# Altium project 4ADI_2DO.PrjPCB (part 5 of 6)

## Sheet AnalogOutputs.SchDoc
size A3
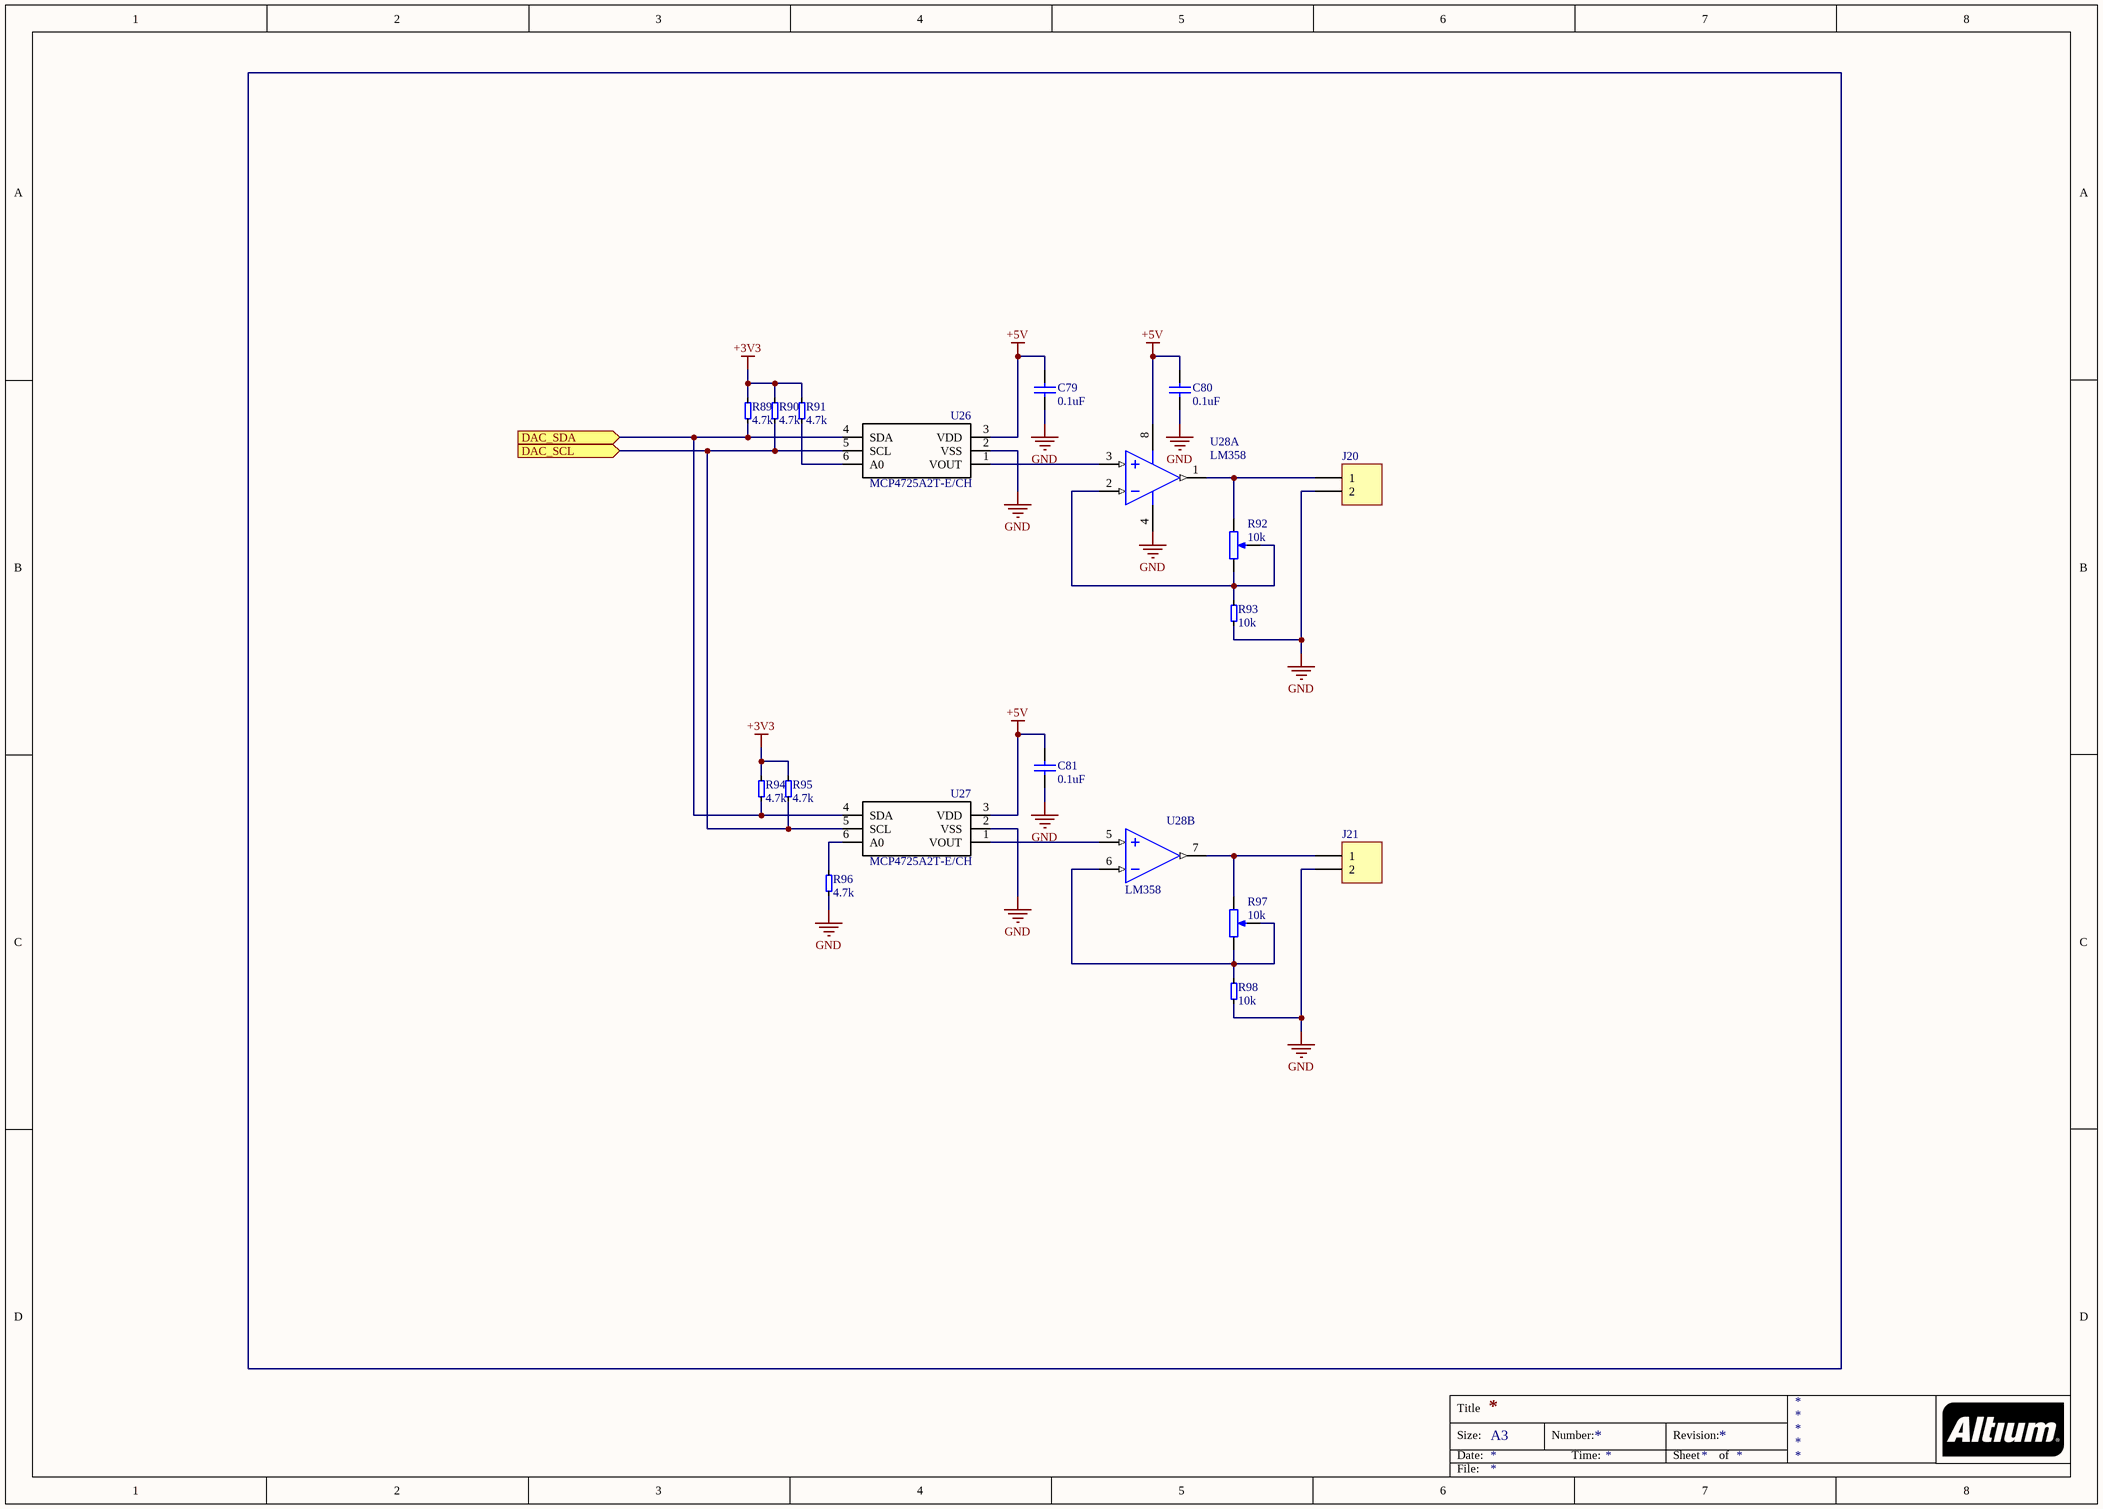
[diagram p5: AnalogOutputs.SchDoc]

### Parts
C79  0.1uF  [C_ceramic_0603]
C80  0.1uF  [C_ceramic_0603]
C81  0.1uF  [C_ceramic_0603]
J20  CIM025P5  [HDR1X2]  (value not drawn)
J21  CIM025P5  [HDR1X2]  (value not drawn)
R89  4.7k  [R_0603]
R90  4.7k  [R_0603]
R91  4.7k  [R_0603]
R92  10k  [ST4EA_Trimmer]
R93  10k  [R_0603]
R94  4.7k  [R_0603]
R95  4.7k  [R_0603]
R96  4.7k  [R_0603]
R97  10k  [ST4EA_Trimmer]
R98  10k  [R_0603]
U26  MCP4725A2T-E/CH  [SOT-23-6_MC]
U27  MCP4725A2T-E/CH  [SOT-23-6_MC]
U28  LM358  [SOIC-8 - 3.9mm Body]  (parts A,B of 2)

### Ports
DAC_SCL (in), DAC_SDA (in)

### Nets
+3V3: R89.1 R90.1 R91.1 R94.1 R95.1
+5v: C79.2 C80.2 C81.2 U26.3(VDD) U27.3(VDD) U28.8(V+)
GND: C79.1 C80.1 C81.1 J20.2 J21.2 R93.2 R96.2 R98.2 U26.2(VSS) U27.2(VSS) U28.4(GND)
NetJ20_1: J20.1 R92.1(TOP) U28.1(OUT_A)
NetJ21_1: J21.1 R97.1(TOP) U28.7(OUT_B)
NetR89_2: R89.2 R94.2 U26.4(SDA) U27.4(SDA) ; port DAC_SDA
NetR90_2: R90.2 R95.2 U26.5(SCL) U27.5(SCL) ; port DAC_SCL
NetR91_2: R91.2 U26.6(A0)
NetR92_2: R92.2(BOT) R92.3(TAP) R93.1 U28.2(IN_A-)
NetR96_1: R96.1 U27.6(A0)
NetR97_2: R97.2(BOT) R97.3(TAP) R98.1 U28.6(IN_B-)
NetU26_1: U26.1(VOUT) U28.3(IN_A+)
NetU27_1: U27.1(VOUT) U28.5(IN_B+)

### Notes on the sheet
- Title
- Size:
- Date:
- A3
- Number:
- Time:
- Revision:
- Sheet
- of
- File:

### Library data of the parts
C79-C81 = Cap: CAP CER 0.1UF 50V X7R 0603; Manufacturer: Yageo; Manufacturer Part Number: CC0603KPX7R9BB104; Supplier 1: Digi-Key; Supplier Part Number 1: 311-3567-1-ND
J20 J21 = Header 2: TERM BLK 2P SIDE ENT 5.08MM PCB; Manufacturer: Sauro; Manufacturer Part Number: CIM025P5; Supplier 1: Digi-Key
R89-R91 R93-R96 R98 = R_0402: RES SMD 80.6K OHM 1% 1/10W 0603; Manufacturer: Yageo; Manufacturer Part Number: RC0603FR-0780K6L; Resistance: 80.6kR; Temperature Coefficient: 100ppm/°C; Power Rating: 100mW; Voltage Rating: 50V; ComponentLink1URL: http://www.farnell.com/datasheets/2167052.pdf?src-supplier=Element14; ComponentLink1Description: http://www.farnell.com/datasheets/2167052.pdf?src-supplier=Element14; ComponentLink2URL: http://www.farnell.com/datasheets/1784430.pdf?src-supplier=Element14; ComponentLink2Description: http://www.farnell.com/datasheets/1784430.pdf?src-supplier=Element14; ComponentLink3URL: http://documents.rs-components.com/techlib://itc_doclist_GB.htm?stockno=6185832&src-supplier=RSComponents; ComponentLink3Description: http://documents.rs-components.com/techlib://itc_doclist_GB.htm?stockno=6185832&src-supplier=RSComponents; ComponentLink4URL: http://www.yageo.com/documents/recent/PYu-RC0402_51_RoHS_L_6_r.pdf?src-supplier=Future+Electronics; ComponentLink4Description: http://www.yageo.com/documents/recent/PYu-RC0402_51_RoHS_L_6_r.pdf?src-supplier=Future+Electronics; ComponentLink5URL: http://www.farnell.com/datasheets/1686128.pdf?src-supplier=Element14; ComponentLink5Description: http://www.farnell.com/datasheets/1686128.pdf?src-supplier=Element14; ComponentLink6URL: http://www.farnell.com/datasheets/1018594.pdf?src-supplier=Element14; ComponentLink6Description: http://www.farnell.com/datasheets/1018594.pdf?src-supplier=Element14; ComponentLink7URL: http://www.yageo.com/documents/recent/PYu-RC_Group_51_RoHS_L_9.pdf?src-supplier=Mouser; ComponentLink7Description: http://www.yageo.com/documents/recent/PYu-RC_Group_51_RoHS_L_9.pdf?src-supplier=Mouser; Supplier 1: Digi-Key; Supplier 2: Digi-Key; Supplier Part Number 2: 311-80.6KHRCT-ND; Stock 2: 487759; Pricing 2: 1=0.1, 10=0.023, 100=0.0094, 1000=0.00421, 2500=0.00366 (USD); Mount: Surface Mount; Case/Package: 0603; Contact Plating: Tin,Matte; Case Code (Metric): 1608; Case Code (Imperial): 0603; Min Operating Temperature: -55°C; Max Operating Temperature: 155°C; Tolerance: 1%; Composition: Thick Film; Packaging: Tape and Reel; Package Quantity: 1; Number of Terminations: 2; Termination: SMD/SMT; Military Standard: Not; Max Power Dissipation: 100mW; Voltage Rating (DC): 50V; Features: Moisture Resistant; Length: 1.6mm; Height: 0.45mm; Width: 0.031inch; Depth: 0.8mm; Radiation Hardening: No; Lead Free: Lead Free; ComponentLink8URL: http://www.yageo.com/documents/recent/PYu-RC_Group_51_RoHS_L_9.pdf?src-supplier=Digi-Key; ComponentLink8Description: http://www.yageo.com/documents/recent/PYu-RC_Group_51_RoHS_L_9.pdf?src-supplier=Digi-Key; ComponentLink9URL: http://www.yageo.com/documents/recent/PYu-RC_Group_51_RoHS_L_10.pdf?src-supplier=Digi-Key; ComponentLink9Description: http://www.yageo.com/documents/recent/PYu-RC_Group_51_RoHS_L_10.pdf?src-supplier=Digi-Key; ComponentLink10URL: http://www.mouser.com/catalog/specsheets/RC0603.pdf?src-supplier=Mouser; ComponentLink10Description: http://www.mouser.com/catalog/specsheets/RC0603.pdf?src-supplier=Mouser; ComponentLink11URL: http://documents.rs-components.com/techlib://itc_doclist_GB.htm?stockno=5048473&src-supplier=RSComponents; ComponentLink11Description: http://documents.rs-components.com/techlib://itc_doclist_GB.htm?stockno=5048473&src-supplier=RSComponents
R92 R97 = RPot: Potentiometer; Sim Note: Enter the Resistance value and the set point into parameter fields.; Set Position: 0.5; Value: 1K; Published: 8-Jun-2000; LatestRevisionDate: 17-Jul-2002; LatestRevisionNote: Re-released for DXP Platform.; PackageReference: VR5; Publisher: Altium Limited; PackageDescription: Variable Resistor, Thru-Hole; 3 Leads
U26 U27 = MCP4725A2T-E/CH: 12 Bit Digital to Analog Converter 1 SOT-23-6; MF: Microchip; Availability: Unavailable; SnapEDA_Link: https://www.snapeda.com/parts/MCP4725A2T-E/CH/Microchip/view-part/108042/?ref=snap; MP: MCP4725A2T-E/CH; Price: None; Package: SOT-23-6 Microchip; Value: *
U28 = Op Amp: Linear Operational Amplifier; Published: 8-Jun-2000; LatestRevisionDate: 17-Jul-2002; LatestRevisionNote: Re-released for DXP Platform.; DatasheetVersion: REV. B; PackageVersion: 1990; PackageReference: H-08A; Publisher: Altium Limited; PackageDescription: Can; 8 Leads; Pin Circle Dia. 5.08 mm; Lead Dia. 0.53 mm (max); ComponentLink1Description: Manufacturer Link; ComponentLink1URL: http://www.analog.com/

## Sheet ISOinputs.SchDoc
size A3
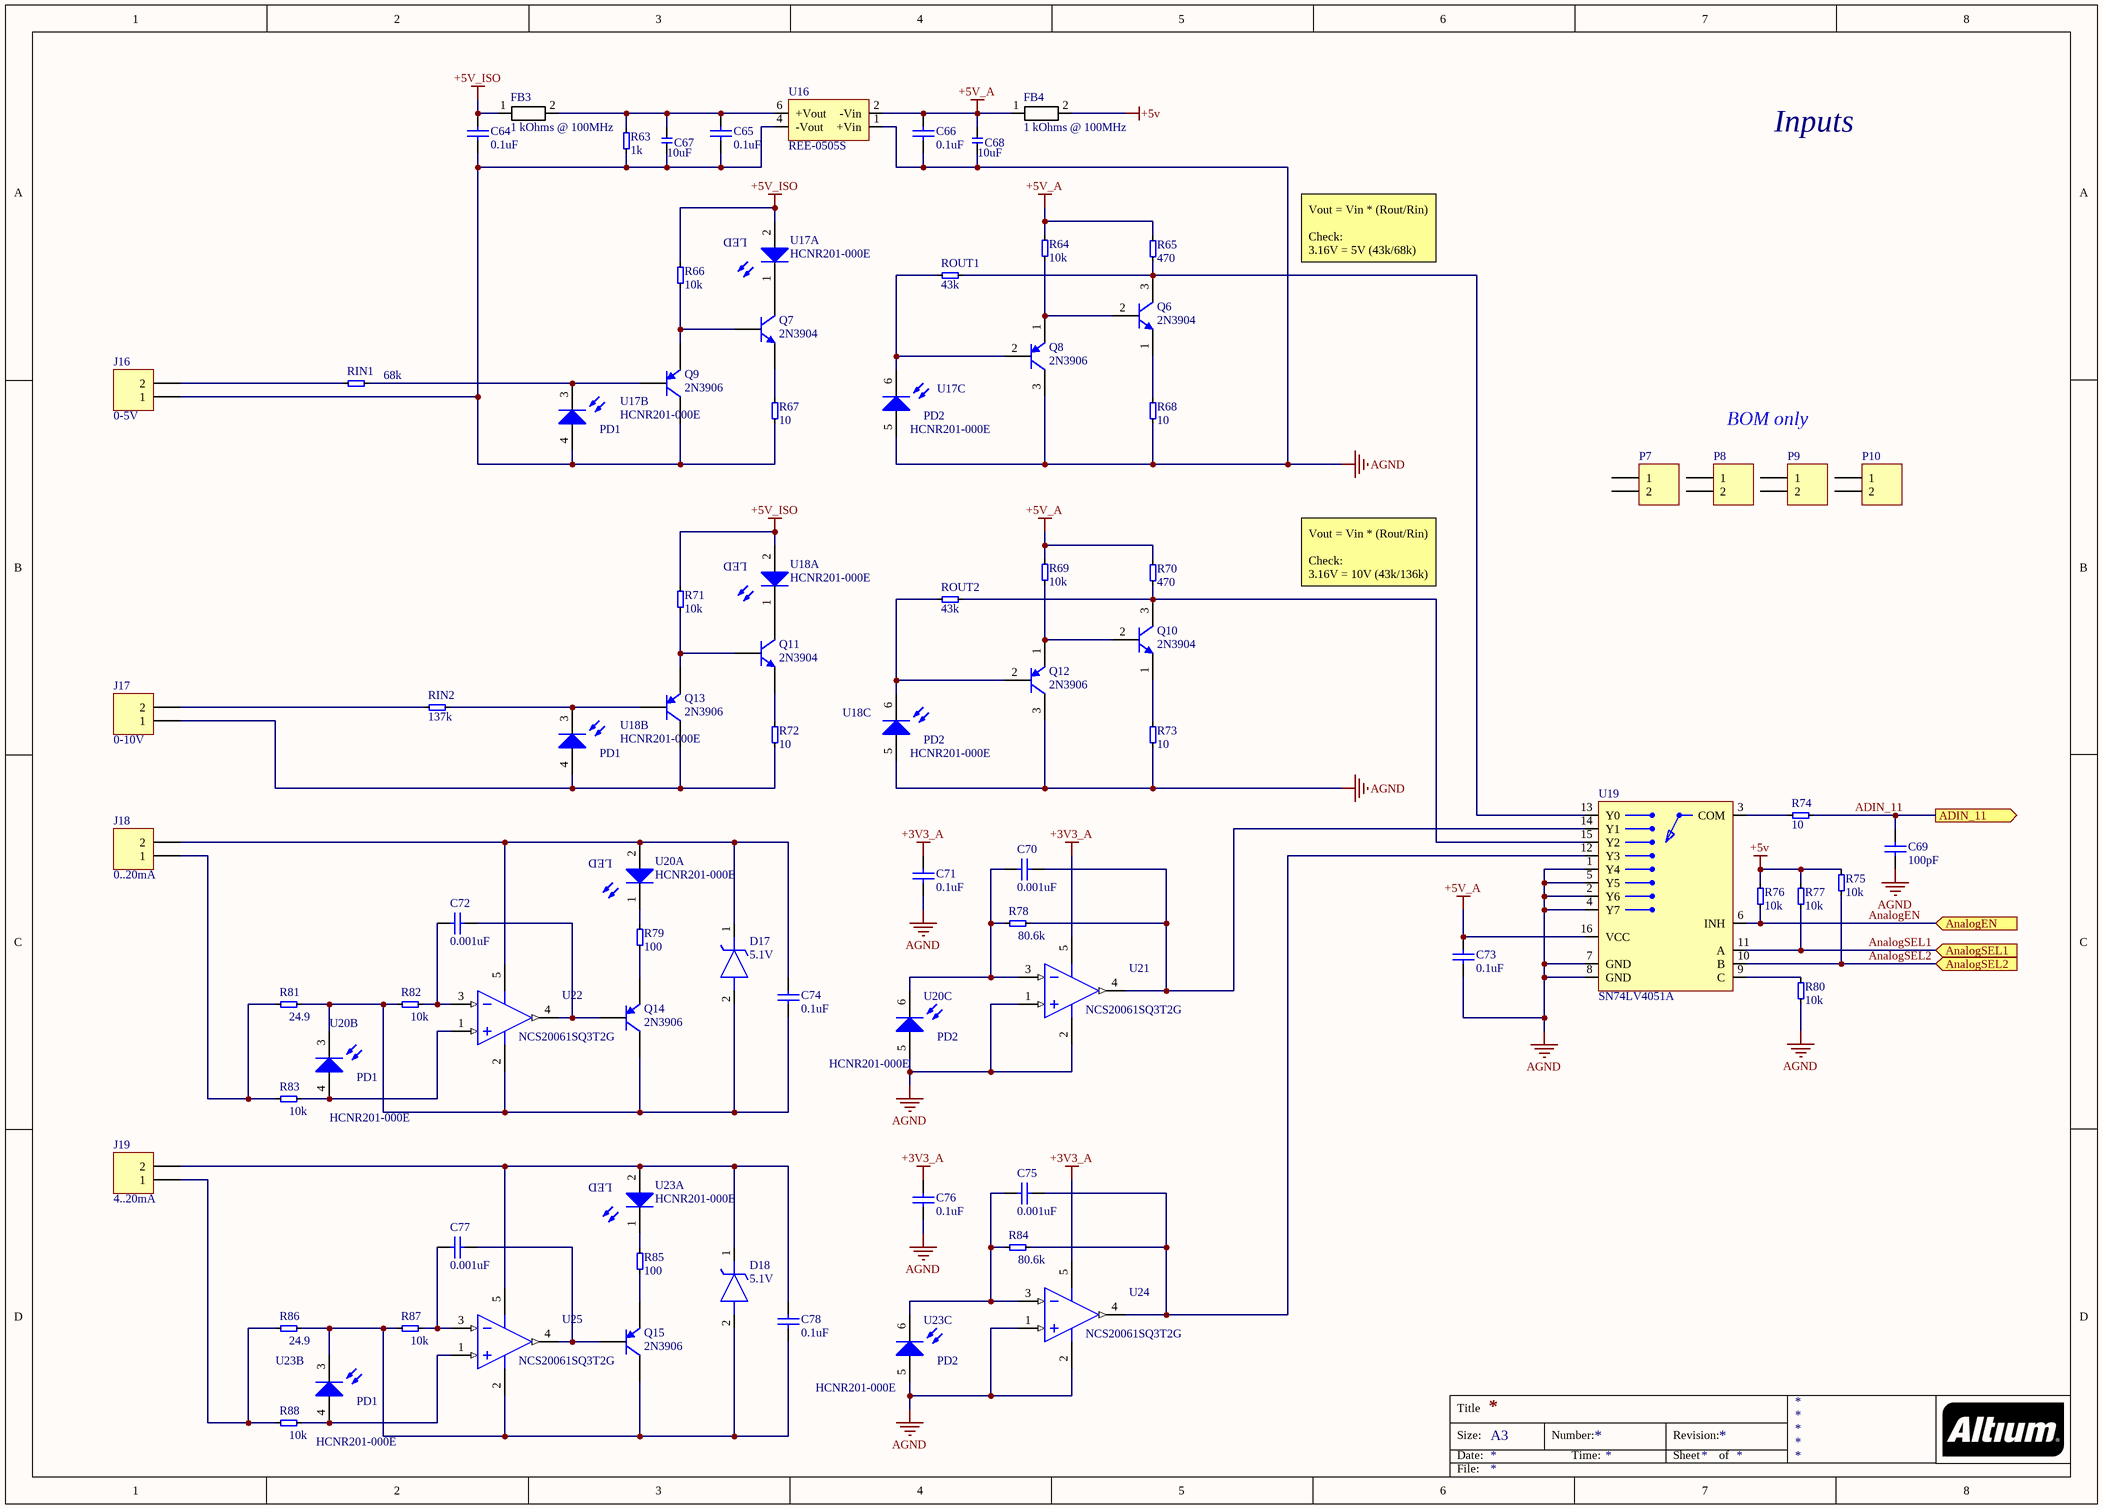
[diagram p6: ISOinputs.SchDoc]

### Parts
C64  0.1uF  [C_ceramic_0603]
C65  0.1uF  [C_ceramic_0603]
C66  0.1uF  [C_ceramic_0603]
C67  10uF  [C0603]
C68  10uF  [C0603]
C69  100pF  [C_ceramic_0603]
C70  0.001uF  [C_ceramic_0603]
C71  0.1uF  [C_ceramic_0603]
C72  0.001uF  [C_ceramic_0603]
C73  0.1uF  [C_ceramic_0603]
C74  0.1uF  [C_ceramic_0603]
C75  0.001uF  [C_ceramic_0603]
C76  0.1uF  [C_ceramic_0603]
C77  0.001uF  [C_ceramic_0603]
C78  0.1uF  [C_ceramic_0603]
D17  5.1V  [SOD_123_CA]
D18  5.1V  [SOD_123_CA]
FB3  1 kOhms @ 100MHz  [FB 16080]
FB4  1 kOhms @ 100MHz  [FB 16080]
J16  CIM025P5  [CON2_P5.08_CIM025P5]  (value not drawn)
J17  CIM025P5  [CON2_P5.08_CIM025P5]  (value not drawn)
J18  CIM025P5  [CON2_P5.08_CIM025P5]  (value not drawn)
J19  CIM025P5  [CON2_P5.08_CIM025P5]  (value not drawn)
P7  BOM ONLY  (value not drawn)  (mechanical)
P8  BOM ONLY  (value not drawn)  (mechanical)
P9  BOM ONLY  (value not drawn)  (mechanical)
P10  BOM ONLY  (value not drawn)  (mechanical)
Q6  2N3904  [TO-92A]
Q7  2N3904  [TO-92A]
Q8  2N3906  [TO-92A]
Q9  2N3906  [TO-92A]
Q10  2N3904  [TO-92A]
Q11  2N3904  [TO-92A]
Q12  2N3906  [TO-92A]
Q13  2N3906  [TO-92A]
Q14  2N3906  [TO-92A]
Q15  2N3906  [TO-92A]
R63  1k  [R_0603]
R64  10k  [R_0603]
R65  470  [RES_C1206(3216)_M]
R66  10k  [R_0603]
R67  10  [RES_C1206(3216)_M]
R68  10  [RES_C1206(3216)_M]
R69  10k  [R_0603]
R70  470  [RES_C1206(3216)_M]
R71  10k  [R_0603]
R72  10  [RES_C1206(3216)_M]
R73  10  [RES_C1206(3216)_M]
R74  10  [R_0603]
R75  10k  [R_0603]
R76  10k  [R_0603]
R77  10k  [R_0603]
R78  80.6k  [R_0603]
R79  100  [R_0603]
R80  10k  [R_0603]
R81  24.9  [R_0603]
R82  10k  [R_0603]
R83  10k  [R_0603]
R84  80.6k  [R_0603]
R85  100  [R_0603]
R86  24.9  [R_0603]
R87  10k  [R_0603]
R88  10k  [R_0603]
RIN1  68k  [R_0603]
RIN2  137k  [R_0603]
ROUT1  43k  [R_0603]
ROUT2  43k  [R_0603]
U16  REE-0505S  [SIP_7]
U17  HCNR201-000E  [dip_8]  (parts A,B,C of 3)
U18  HCNR201-000E  [dip_8]  (parts A,B,C of 3)
U19  SN74LV4051A  [SOIC-16_10x4mm_P1.27]
U20  HCNR201-000E  [dip_8]  (parts A,B,C of 3)
U21  NCS20061SQ3T2G  [SOT-353-5]
U22  NCS20061SQ3T2G  [SOT-353-5]
U23  HCNR201-000E  [dip_8]  (parts A,B,C of 3)
U24  NCS20061SQ3T2G  [SOT-353-5]
U25  NCS20061SQ3T2G  [SOT-353-5]

### Ports
ADIN_11 (out), AnalogEN (in), AnalogSEL1 (in), AnalogSEL2 (in)

### Nets
+3V3_A: C71.2 C76.2 U21.5(V+) U24.5(V+)
+5v: FB4.2 R75.2 R76.2 R77.2
+5V_A: C66.2 C68.2 C73.2 FB4.1 R64.1 R65.1 R69.1 R70.1 U16.2(-Vin) U19.16(VCC)
+5V_ISO: C64.2 FB3.1 R66.1 R71.1 U17.2(A) U18.2(A)
AGND: C66.1 C68.1 C69.1 C71.1 C73.1 C76.1 Q8.3(C) Q12.3(C) R68.2 R73.2 R80.1 U16.1(+Vin) U17.5(A) U18.5(A) U19.1(Y4) U19.2(Y6) U19.4(Y7) U19.5(Y5) U19.7(GND) U19.8(GND) U20.5(A) U21.1(+IN) U21.2(V-) U23.5(A) U24.1(+IN) U24.2(V-)
ADIN_11: C69.2 R74.2 ; port ADIN_11
AnalogEN: R76.1 U19.6(INH) ; port AnalogEN
AnalogSEL1: R77.1 U19.11(A) ; port AnalogSEL1
AnalogSEL2: R75.1 U19.10(B) ; port AnalogSEL2
NetC64_1: C64.1 C65.1 C67.1 J16.1 Q9.3(C) R63.2 R67.2 U16.4(-Vout) U17.4(A)
NetC65_2: C65.2 C67.2 FB3.2 R63.1 U16.6(+Vout)
NetC70_1: C70.1 R78.2 U20.6(K) U21.3(-IN)
NetC70_2: C70.2 R78.1 U19.14(Y1) U21.4(OUT)
NetC72_1: C72.1 R82.1 U22.3(-IN)
NetC72_2: C72.2 Q14.2(B) U22.4(OUT)
NetC74_1: C74.1 D17.1(K) J18.2 U20.2(A) U22.5(V+)
NetC74_2: C74.2 D17.2(A) Q14.3(C) R81.1 R82.2 U20.3(K) U22.2(V-)
NetC75_1: C75.1 R84.2 U23.6(K) U24.3(-IN)
NetC75_2: C75.2 R84.1 U19.12(Y3) U24.4(OUT)
NetC77_1: C77.1 R87.1 U25.3(-IN)
NetC77_2: C77.2 Q15.2(B) U25.4(OUT)
NetC78_1: C78.1 D18.1(K) J19.2 U23.2(A) U25.5(V+)
NetC78_2: C78.2 D18.2(A) Q15.3(C) R86.1 R87.2 U23.3(K) U25.2(V-)
NetJ16_2: J16.2 RIN1.1
NetJ17_1: J17.1 Q13.3(C) R72.2 U18.4(A)
NetJ17_2: J17.2 RIN2.1
NetJ18_1: J18.1 R81.2 R83.2
NetJ19_1: J19.1 R86.2 R88.2
NetQ6_1: Q6.1(E) R68.1
NetQ6_2: Q6.2(B) Q8.1(E) R64.2
NetQ6_3: Q6.3(C) R65.2 ROUT1.2 U19.13(Y0)
NetQ7_1: Q7.1(E) R67.1
NetQ7_2: Q7.2(B) Q9.1(E) R66.2
NetQ7_3: Q7.3(C) U17.1(K)
NetQ8_2: Q8.2(B) ROUT1.1 U17.6(K)
NetQ9_2: Q9.2(B) RIN1.2 U17.3(K)
NetQ10_1: Q10.1(E) R73.1
NetQ10_2: Q10.2(B) Q12.1(E) R69.2
NetQ10_3: Q10.3(C) R70.2 ROUT2.2 U19.15(Y2)
NetQ11_1: Q11.1(E) R72.1
NetQ11_2: Q11.2(B) Q13.1(E) R71.2
NetQ11_3: Q11.3(C) U18.1(K)
NetQ12_2: Q12.2(B) ROUT2.1 U18.6(K)
NetQ13_2: Q13.2(B) RIN2.2 U18.3(K)
NetQ14_1: Q14.1(E) R79.2
NetQ15_1: Q15.1(E) R85.2
NetR74_1: R74.1 U19.3(COM)
NetR79_1: R79.1 U20.1(K)
NetR80_2: R80.2 U19.9(C)
NetR83_1: R83.1 U20.4(A) U22.1(+IN)
NetR85_1: R85.1 U23.1(K)
NetR88_1: R88.1 U23.4(A) U25.1(+IN)

Not connected (* = marked no-connect by the designer): P7 1 2; P8 1 2; P9 1 2; P10 1 2

### Notes on the sheet
- Inputs
- Vout = Vin * (Rout/Rin)
  Check:
  3.16V = 5V (43k/68k)
- (near J16) 0-5V
- BOM only
- Vout = Vin * (Rout/Rin)
  Check:
  3.16V = 10V (43k/136k)
- (near J17) 0-10V
- (near J18) 0..20mA
- (near J19) 4..20mA
- Title
- Size:
- Date:
- A3
- Number:
- Time:
- Revision:
- Sheet
- of
- File:
- (in symbol HCNR200, part A) LED
- (in symbol HCNR200, part B) PD1
- (in symbol HCNR200, part C) PD2

### Library data of the parts
C64-C66 C71 C73 C74 C76 C78 = Cap: as C79 on sheet AnalogOutputs; Supplier 1: Digi-Key; Supplier Part Number 1: 311-3567-1-ND
C67 C68 = CAP_0603: CAP CER 10UF 10V X5R 0603; Manufacturer: Murata; Manufacturer Part Number: GRM188R61A106KE69D; Tolerance: 10%; Supplier 1: Digi-Key; Supplier Part Number 1: 490-10474-1-ND; Stock 1: 6085579; Pricing 1: 1=0.21, 10=0.141, 100=0.0713, 500=0.04876, 1000=0.04313 (USD); Mount: Surface Mount; Case/Package: 0603; Case Code (Metric): 1608; Case Code (Imperial): 0603; Min Operating Temperature: -55°C; Max Operating Temperature: 85°C; Capacitance: 10uF; Packaging: Tape and Reel; Dielectric: X5R; Voltage Rating: 10V; Voltage: 10V; Voltage Rating (DC): 10V; Length: 1.6mm; Height: 0.8mm; Width: 0.031inch; Thickness: 0.037inch; Depth: 0.8mm; REACH SVHC: No SVHC; Lead Free: Lead Free
C69 = Cap: CAP CER 100PF 50V C0G/NPO 0603; Manufacturer: Yageo; Manufacturer Part Number: CC0603JRNPO9BN101; Supplier 1: Digi-Key; Supplier Part Number 1: 311-1069-1-ND
C70 C72 C75 C77 = Cap: CAP CER 1000PF 50V C0G/NPO 0603; Manufacturer: Yageo; Manufacturer Part Number: CC0603JRNPO9BN102; Capacitance: 1nF; Tolerance: 5%; Dielectric: C0G; Supplier 1: Digi-Key; Supplier Part Number 1: 311-1423-1-ND; Stock 1: 441300; Pricing 1: 1=0.1, 10=0.07, 100=0.0313, 500=0.02234, 1000=0.01755 (USD); Mount: Surface Mount; Case/Package: 0603; Case Code (Imperial): 0603; Case Code (Metric): 1608; Min Operating Temperature: -55°C; Max Operating Temperature: 125°C; Voltage Rating: 50V; Packaging: Tape and Reel; Package Quantity: 1; Voltage Rating (DC): 50V; Termination: SMD/SMT; Composition: Ceramic; Voltage: 50V; Length: 1.6mm; Height: 0.8mm; Width: 0.8mm; Thickness: 0.035inch; Depth: 0.8mm; Radiation Hardening: No; REACH SVHC: No SVHC; Lead Free: Lead Free; ComponentLink1URL: http://www.mouser.com/ds/2/447/Yageo_UPY-GP_NP0_16V-to-50V_9-358835.pdf?src-supplier=Mouser; ComponentLink1Description: http://www.mouser.com/ds/2/447/Yageo_UPY-GP_NP0_16V-to-50V_9-358835.pdf?src-supplier=Mouser; ComponentLink2URL: https://www.verical.com/server-webapp/html/getDatasheet?partID=314873&src-supplier=Verical; ComponentLink2Description: https://www.verical.com/server-webapp/html/getDatasheet?partID=314873&src-supplier=Verical; ComponentLink3URL: http://www.yageo.com/documents/recent/UPY-GP_NP0_16V-to-50V_16.pdf?src-supplier=Digi-Key; ComponentLink3Description: http://www.yageo.com/documents/recent/UPY-GP_NP0_16V-to-50V_16.pdf?src-supplier=Digi-Key; ComponentLink4URL: http://www.yageo.com/documents/recent/UPY-GP_NP0_16V-to-50V_8.pdf?src-supplier=Avnet; ComponentLink4Description: http://www.yageo.com/documents/recent/UPY-GP_NP0_16V-to-50V_8.pdf?src-supplier=Avnet
D17 D18 = ZNR_PLZ5V1C-HG3_H: DIODE ZENER 5.1V 365MW SOD123; Manufacturer: Nexperia; Manufacturer Part Number: PDZ5.1BGWJ; ComponentLink1URL: http://www.mccsemi.com/up_pdf/MMSZ4678-MMSZ4716(SOD-123)-D.pdf?src-supplier=Digi-Key; ComponentLink1Description: http://www.mccsemi.com/up_pdf/MMSZ4678-MMSZ4716(SOD-123)-D.pdf?src-supplier=Digi-Key; Supplier 1: Digi-Key; Supplier Part Number 1: 1727-7769-1-ND; Stock 1: 18751; Pricing 1: 1=0.17, 10=0.158, 100=0.0862, 500=0.05302, 1000=0.03615 (USD)
FB3 FB4 = Ferrite bead: FERRITE BEAD 1 KOHM 0603 1LN; Manufacturer: Wurth Electronics; Manufacturer Part Number: 74279266; Tolerance: 25%; Impedance: 1kR; Current Rating: 200mA; DC Resistance (DCR): 600mR; Inductance: 1.8nH; Shielding: Unshielded; Supplier 1: Digi-Key; Supplier Part Number 1: 732-4484-1-ND; Stock 1: 104717; Pricing 1: 1=0.17, 50=0.168, 100=0.155, 500=0.148, 1000=0.141, 2000=0.134 (USD); Case/Package: SMD/SMT; Case Code (Metric): 1608; Case Code (Imperial): 0603; Core Material: Ferrite; Min Operating Temperature: -55°C; Max Operating Temperature: 125°C; Packaging: Tape and Reel; Max DC Current: 200mA; Termination: SMD/SMT; Test Frequency: 100MHz; Length: 1.6mm; Height: 0.8mm; Depth: 0.8mm; Width: 0.8mm; REACH SVHC: Unknown; Lead Free: Lead Free; ComponentLink1URL: http://docs-europe.electrocomponents.com/webdocs/1408/0900766b8140888f.pdf?src-supplier=Allied+Electronics; ComponentLink1Description: http://docs-europe.electrocomponents.com/webdocs/1408/0900766b8140888f.pdf?src-supplier=Allied+Electronics; ComponentLink2URL: http://documents.rs-components.com/techlib://itc_doclist_GB.htm?stockno=3674856&src-supplier=RSComponents; ComponentLink2Description: http://documents.rs-components.com/techlib://itc_doclist_GB.htm?stockno=3674856&src-supplier=RSComponents; ComponentLink3URL: https://katalog.we-online.de/pbs/datasheet/74279266.pdf?src-supplier=Digi-Key; ComponentLink3Description: https://katalog.we-online.de/pbs/datasheet/74279266.pdf?src-supplier=Digi-Key; ComponentLink4URL: http://www.farnell.com/datasheets/1920067.pdf?src-supplier=Element14; ComponentLink4Description: http://www.farnell.com/datasheets/1920067.pdf?src-supplier=Element14; ComponentLink5URL: http://www.mouser.com/ds/2/445/74279266-221135.pdf?src-supplier=Mouser; ComponentLink5Description: http://www.mouser.com/ds/2/445/74279266-221135.pdf?src-supplier=Mouser; ComponentLink6URL: http://www.produktinfo.conrad.com/datenblaetter/1000000-1099999/001087059-da-01-ml-WE_CBF_SMD_FERRIT_74279266_de_en.pdf?src-supplier=Conrad; ComponentLink6Description: http://www.produktinfo.conrad.com/datenblaetter/1000000-1099999/001087059-da-01-ml-WE_CBF_SMD_FERRIT_74279266_de_en.pdf?src-supplier=Conrad
J16-J19 = Header 2: as J20 on sheet AnalogOutputs; Manufacturer Part Number: CIM025P5; Supplier 1: Digi-Key
P7-P10 = Header 2: Plug; Manufacturer: Sauro; Manufacturer Part Number: CIF02005; Supplier 1: Digi-Key
Q6 Q7 Q10 Q11 = 2N3904: TRANS NPN 40V 0.2A TO-92; Manufacturer: ON Semiconductor / Fairchild; Manufacturer Part Number: 2N3904BU; Max Power Dissipation: 625mW; Number of Elements: 1; hFE Min: 100; Frequency: 300MHz; Max Collector Current: 200mA; Collector Base Voltage (VCBO): 60V; Emitter Base Voltage (VEBO): 6V; Collector Emitter Saturation Voltage: 300mV; Element Configuration: Single; ComponentLink1Description: Manufacturer Link; ComponentLink1URL: http://www.fairchildsemi.com/; ComponentLink2Description: Datasheet; ComponentLink2URL: http://www.fairchildsemi.com/ds/2N%2F2N3904.pdf; Supplier 1: Digi-Key; Supplier Part Number 1: 2N3904FS-ND; Stock 1: 161974; Pricing 1: 1=0.2, 10=0.162, 100=0.0861, 500=0.05662, 1000=0.03851 (USD); Mount: Through Hole; Case/Package: TO-92; Number of Pins: 3; Weight: 0.179g; Min Operating Temperature: -55°C; Max Operating Temperature: 150°C; Package Quantity: 1000; Collector Emitter Voltage (VCEO): 40V; Packaging: Bulk; Transition Frequency: 300MHz; Polarity: NPN; Collector Emitter Breakdown Voltage: 40V; Power Dissipation: 625mW; Max Frequency: 300MHz; Gain Bandwidth Product: 300MHz; Voltage Rating (DC): 60V; Current Rating: 200mA; Length: 5.2mm; Height: 5.33mm; Width: 4.19mm; Radiation Hardening: No; REACH SVHC: No SVHC; Lead Free: Lead Free; ComponentLink3URL: https://www.fairchildsemi.com/datasheets/MM/MMBT3904.pdf?src-supplier=Digi-Key; ComponentLink3Description: https://www.fairchildsemi.com/datasheets/MM/MMBT3904.pdf?src-supplier=Digi-Key; ComponentLink4URL: http://www.fairchildsemi.com/ds/MM/MMBT3904.pdf?src-supplier=Avnet+Europe; ComponentLink4Description: http://www.fairchildsemi.com/ds/MM/MMBT3904.pdf?src-supplier=Avnet+Europe; ComponentLink5URL: http://www.jameco.com/Jameco/Products/ProdDS/783421.pdf?src-supplier=Jameco; ComponentLink5Description: http://www.jameco.com/Jameco/Products/ProdDS/783421.pdf?src-supplier=Jameco; ComponentLink6URL: https://www.verical.com/server-webapp/html/getDatasheet?partID=185752&src-supplier=Verical; ComponentLink6Description: https://www.verical.com/server-webapp/html/getDatasheet?partID=185752&src-supplier=Verical
Q8 Q9 Q12-Q15 = 2N3906: TRANS PNP 40V TO-92; Manufacturer: Central Semiconductor; hFE Min: 100; Max Power Dissipation: 625mW; Max Collector Current: 50nA; Transition Frequency: 250MHz; Emitter Base Voltage (VEBO): 5V; Collector Emitter Saturation Voltage: 400mV; Continuous Collector Current: 200mA; Element Configuration: Single; ComponentLink1Description: Manufacturer Link; ComponentLink1URL: http://www.fairchildsemi.com/; ComponentLink2Description: Datasheet; ComponentLink2URL: http://www.fairchildsemi.com/ds/2N%2F2N3906.pdf; Supplier 1: Digi-Key; Supplier Part Number 1: 1514-2N3906PBFREE-ND; Manufacturer Part Number: 2N3906; Stock 1: 15252; Pricing 1: 1=0.42, 10=0.314, 25=0.2832, 100=0.1957, 250=0.1648, 500=0.1339, 1000=0.103, 2500=0.0927, 5000=0.08755 (USD); Mount: Through Hole; Case/Package: TO-92; Packaging: Bulk; Package Quantity: 2500; Collector Emitter Voltage (VCEO): 40V; Polarity: PNP; Collector Base Voltage (VCBO): 40V; Collector Emitter Breakdown Voltage: 40V; Gain Bandwidth Product: 250MHz; Lead Free: Lead Free; ComponentLink3URL: http://www.mouser.com/ds/2/68/2n3905-29545.pdf?src-supplier=Mouser; ComponentLink3Description: http://www.mouser.com/ds/2/68/2n3905-29545.pdf?src-supplier=Mouser
  Q8 Q9 Q12 Q13: Published: 8-Jun-2000; LatestRevisionDate: 15-Jan-2003; LatestRevisionNote: PCB Footprint 'BCY-W3/D4.7' replaced; DatasheetVersion: 1997; PackageVersion: Sep-1998; PackageReference: TO-92A; Publisher: Altium Limited; PackageDescription: TO, Flat Index; 3 In-Line, Axial Leads; Body Dia. 4.5mm; Leads 0.51 x 0.48 mm (max)
R63 = R_0402: RES SMD 1K OHM 1% 1/10W 0603; Manufacturer: Yageo; Manufacturer Part Number: RC0603FR-071KL; ComponentLink1URL: http://documents.rs-components.com/techlib://itc_doclist_GB.htm?stockno=6186122&src-supplier=RSComponents; ComponentLink1Description: http://documents.rs-components.com/techlib://itc_doclist_GB.htm?stockno=6186122&src-supplier=RSComponents; ComponentLink2URL: http://www.mouser.com/ds/2/447/PYu-RC0402_51_RoHS_L_6_r-8721.pdf?src-supplier=Mouser; ComponentLink2Description: http://www.mouser.com/ds/2/447/PYu-RC0402_51_RoHS_L_6_r-8721.pdf?src-supplier=Mouser; ComponentLink3URL: http://www.yageo.com/documents/recent/PYu-RC0402_51_RoHS_L_6_r.pdf?src-supplier=Future+Electronics; ComponentLink3Description: http://www.yageo.com/documents/recent/PYu-RC0402_51_RoHS_L_6_r.pdf?src-supplier=Future+Electronics; ComponentLink4URL: http://www.farnell.com/datasheets/1018594.pdf?src-supplier=Element14; ComponentLink4Description: http://www.farnell.com/datasheets/1018594.pdf?src-supplier=Element14; ComponentLink5URL: http://www.farnell.com/datasheets/2167052.pdf?src-supplier=Element14; ComponentLink5Description: http://www.farnell.com/datasheets/2167052.pdf?src-supplier=Element14; Supplier 1: Digi-Key; Supplier Part Number 1: 311-1.00KHRCT-ND
R64 R66 R69 R71 R75-R77 R80 R82 R83 R87 R88 = R_0402: RES SMD 10K OHM 1% 1/10W 0603; Manufacturer: Yageo; Manufacturer Part Number: RC0603FR-0710KL; ComponentLink1URL: http://www.farnell.com/datasheets/2167052.pdf?src-supplier=Element14; ComponentLink1Description: http://www.farnell.com/datasheets/2167052.pdf?src-supplier=Element14; ComponentLink2URL: http://www.farnell.com/datasheets/1784430.pdf?src-supplier=Element14; ComponentLink2Description: http://www.farnell.com/datasheets/1784430.pdf?src-supplier=Element14; ComponentLink3URL: http://documents.rs-components.com/techlib://itc_doclist_GB.htm?stockno=6185832&src-supplier=RSComponents; ComponentLink3Description: http://documents.rs-components.com/techlib://itc_doclist_GB.htm?stockno=6185832&src-supplier=RSComponents; ComponentLink4URL: http://www.yageo.com/documents/recent/PYu-RC0402_51_RoHS_L_6_r.pdf?src-supplier=Future+Electronics; ComponentLink4Description: http://www.yageo.com/documents/recent/PYu-RC0402_51_RoHS_L_6_r.pdf?src-supplier=Future+Electronics; ComponentLink5URL: http://www.farnell.com/datasheets/1686128.pdf?src-supplier=Element14; ComponentLink5Description: http://www.farnell.com/datasheets/1686128.pdf?src-supplier=Element14; ComponentLink6URL: http://www.farnell.com/datasheets/1018594.pdf?src-supplier=Element14; ComponentLink6Description: http://www.farnell.com/datasheets/1018594.pdf?src-supplier=Element14; ComponentLink7URL: http://www.yageo.com/documents/recent/PYu-RC_Group_51_RoHS_L_9.pdf?src-supplier=Mouser; ComponentLink7Description: http://www.yageo.com/documents/recent/PYu-RC_Group_51_RoHS_L_9.pdf?src-supplier=Mouser; Supplier 1: Digi-Key; Supplier Part Number 1: 311-10.0KHRCT-ND
R65 R70 = R_0402: CRGP 1206 470R 1%; Manufacturer: Yageo; Manufacturer Part Number: CRGP1206F470R; ComponentLink1URL: http://www.farnell.com/datasheets/2167052.pdf?src-supplier=Element14; ComponentLink1Description: http://www.farnell.com/datasheets/2167052.pdf?src-supplier=Element14; ComponentLink2URL: http://www.farnell.com/datasheets/1784430.pdf?src-supplier=Element14; ComponentLink2Description: http://www.farnell.com/datasheets/1784430.pdf?src-supplier=Element14; ComponentLink3URL: http://documents.rs-components.com/techlib://itc_doclist_GB.htm?stockno=6185832&src-supplier=RSComponents; ComponentLink3Description: http://documents.rs-components.com/techlib://itc_doclist_GB.htm?stockno=6185832&src-supplier=RSComponents; ComponentLink4URL: http://www.yageo.com/documents/recent/PYu-RC0402_51_RoHS_L_6_r.pdf?src-supplier=Future+Electronics; ComponentLink4Description: http://www.yageo.com/documents/recent/PYu-RC0402_51_RoHS_L_6_r.pdf?src-supplier=Future+Electronics; ComponentLink5URL: http://www.farnell.com/datasheets/1686128.pdf?src-supplier=Element14; ComponentLink5Description: http://www.farnell.com/datasheets/1686128.pdf?src-supplier=Element14; ComponentLink6URL: http://www.farnell.com/datasheets/1018594.pdf?src-supplier=Element14; ComponentLink6Description: http://www.farnell.com/datasheets/1018594.pdf?src-supplier=Element14; ComponentLink7URL: http://www.yageo.com/documents/recent/PYu-RC_Group_51_RoHS_L_9.pdf?src-supplier=Mouser; ComponentLink7Description: http://www.yageo.com/documents/recent/PYu-RC_Group_51_RoHS_L_9.pdf?src-supplier=Mouser; Supplier 1: Digi-Key; Supplier 2: Digi-Key; Supplier Part Number 2: A130534CT-ND; Stock 2: 45011; Pricing 2: 1=0.33, 10=0.278, 100=0.1088, 1000=0.04555, 2500=0.04175 (USD)
R67 R68 R72 R73 RIN1 RIN2 = R_0402: RES SMD 1206 1/2W 1% 10 OHM; Manufacturer: Yageo; Manufacturer Part Number: SR1206FR-7W10RL; ComponentLink1URL: http://www.farnell.com/datasheets/2167052.pdf?src-supplier=Element14; ComponentLink1Description: http://www.farnell.com/datasheets/2167052.pdf?src-supplier=Element14; ComponentLink2URL: http://www.farnell.com/datasheets/1784430.pdf?src-supplier=Element14; ComponentLink2Description: http://www.farnell.com/datasheets/1784430.pdf?src-supplier=Element14; ComponentLink3URL: http://documents.rs-components.com/techlib://itc_doclist_GB.htm?stockno=6185832&src-supplier=RSComponents; ComponentLink3Description: http://documents.rs-components.com/techlib://itc_doclist_GB.htm?stockno=6185832&src-supplier=RSComponents; ComponentLink4URL: http://www.yageo.com/documents/recent/PYu-RC0402_51_RoHS_L_6_r.pdf?src-supplier=Future+Electronics; ComponentLink4Description: http://www.yageo.com/documents/recent/PYu-RC0402_51_RoHS_L_6_r.pdf?src-supplier=Future+Electronics; ComponentLink5URL: http://www.farnell.com/datasheets/1686128.pdf?src-supplier=Element14; ComponentLink5Description: http://www.farnell.com/datasheets/1686128.pdf?src-supplier=Element14; ComponentLink6URL: http://www.farnell.com/datasheets/1018594.pdf?src-supplier=Element14; ComponentLink6Description: http://www.farnell.com/datasheets/1018594.pdf?src-supplier=Element14; ComponentLink7URL: http://www.yageo.com/documents/recent/PYu-RC_Group_51_RoHS_L_9.pdf?src-supplier=Mouser; ComponentLink7Description: http://www.yageo.com/documents/recent/PYu-RC_Group_51_RoHS_L_9.pdf?src-supplier=Mouser; Supplier 1: Digi-Key
  R67 R68 R72 R73: Supplier 2: Digi-Key; Supplier Part Number 2: YAG5887CT-ND; Stock 2: 8877; Pricing 2: 1=0.56, 10=0.47, 100=0.3153, 1000=0.18448, 2500=0.18247 (USD); ComponentLink8URL: http://www.yageo.com/documents/recent/PYu-SR_D_F%20tol_RoHS_L_3.pdf?src-supplier=Digi-Key; ComponentLink8Description: http://www.yageo.com/documents/recent/PYu-SR_D_F%20tol_RoHS_L_3.pdf?src-supplier=Digi-Key
  RIN1 RIN2: ComponentLink8URL: http://www.yageo.com/documents/recent/PYu-RC_Group_51_RoHS_L_10.pdf?src-supplier=Digi-Key; ComponentLink8Description: http://www.yageo.com/documents/recent/PYu-RC_Group_51_RoHS_L_10.pdf?src-supplier=Digi-Key; ComponentLink9URL: http://documents.rs-components.com/techlib://itc_doclist_GB.htm?stockno=5048243&src-supplier=RSComponents; ComponentLink9Description: http://documents.rs-components.com/techlib://itc_doclist_GB.htm?stockno=5048243&src-supplier=RSComponents; ComponentLink10URL: http://www.yageo.com/documents/recent/PYu-RC_Group_51_RoHS_L_9.pdf?src-supplier=Digi-Key; ComponentLink10Description: http://www.yageo.com/documents/recent/PYu-RC_Group_51_RoHS_L_9.pdf?src-supplier=Digi-Key; ComponentLink11URL: http://www.farnell.com/datasheets/1868787.pdf?src-supplier=Element14; ComponentLink11Description: http://www.farnell.com/datasheets/1868787.pdf?src-supplier=Element14; ComponentLink12URL: http://www.farnell.com/datasheets/443971.pdf?src-supplier=Element14; ComponentLink12Description: http://www.farnell.com/datasheets/443971.pdf?src-supplier=Element14; Supplier Part Number 1: YAG5887CT-ND; Stock 1: 8877; Pricing 1: 1=0.56, 10=0.47, 100=0.3153, 1000=0.18448, 2500=0.18247 (USD); ComponentLink13URL: http://www.yageo.com/documents/recent/PYu-SR_D_F%20tol_RoHS_L_3.pdf?src-supplier=Digi-Key; ComponentLink13Description: http://www.yageo.com/documents/recent/PYu-SR_D_F%20tol_RoHS_L_3.pdf?src-supplier=Digi-Key
R74 = R_0402: RES SMD 10 OHM 1% 1/10W 0603; Manufacturer: Yageo; Manufacturer Part Number: RC0603FR-0710RL; Resistance: 10R; Temperature Coefficient: 200ppm/°C; Voltage Rating (DC): 50V; Power Rating: 100mW; ComponentLink1URL: http://www.farnell.com/datasheets/2167052.pdf?src-supplier=Element14; ComponentLink1Description: http://www.farnell.com/datasheets/2167052.pdf?src-supplier=Element14; ComponentLink2URL: http://www.farnell.com/datasheets/1784430.pdf?src-supplier=Element14; ComponentLink2Description: http://www.farnell.com/datasheets/1784430.pdf?src-supplier=Element14; ComponentLink3URL: http://documents.rs-components.com/techlib://itc_doclist_GB.htm?stockno=6185832&src-supplier=RSComponents; ComponentLink3Description: http://documents.rs-components.com/techlib://itc_doclist_GB.htm?stockno=6185832&src-supplier=RSComponents; ComponentLink4URL: http://www.yageo.com/documents/recent/PYu-RC0402_51_RoHS_L_6_r.pdf?src-supplier=Future+Electronics; ComponentLink4Description: http://www.yageo.com/documents/recent/PYu-RC0402_51_RoHS_L_6_r.pdf?src-supplier=Future+Electronics; ComponentLink5URL: http://www.farnell.com/datasheets/1686128.pdf?src-supplier=Element14; ComponentLink5Description: http://www.farnell.com/datasheets/1686128.pdf?src-supplier=Element14; ComponentLink6URL: http://www.farnell.com/datasheets/1018594.pdf?src-supplier=Element14; ComponentLink6Description: http://www.farnell.com/datasheets/1018594.pdf?src-supplier=Element14; ComponentLink7URL: http://www.yageo.com/documents/recent/PYu-RC_Group_51_RoHS_L_9.pdf?src-supplier=Mouser; ComponentLink7Description: http://www.yageo.com/documents/recent/PYu-RC_Group_51_RoHS_L_9.pdf?src-supplier=Mouser; Supplier 1: Digi-Key; Supplier 2: Digi-Key; Supplier Part Number 2: 311-10.0HRCT-ND; Stock 2: 13150610; Pricing 2: 1=0.1, 10=0.046, 100=0.0187, 1000=0.0084, 2500=0.00729 (USD); Case/Package: 0603; Number of Pins: 2; Case Code (Imperial): 0603; Case Code (Metric): 1608; Contact Plating: Tin,Matte; Min Operating Temperature: -55°C; Max Operating Temperature: 155°C; Tolerance: 1%; Composition: Thick Film; Packaging: Tape and Reel; Military Standard: Not; Voltage Rating: 50V; Termination: SMD/SMT; Length: 1.6mm; Height: 0.45mm; Width: 0.8mm; Depth: 0.8mm; Radiation Hardening: No; Lead Free: Lead Free; REACH SVHC: No SVHC; ComponentLink8URL: http://www.farnell.com/datasheets/1868787.pdf?src-supplier=Element14; ComponentLink8Description: http://www.farnell.com/datasheets/1868787.pdf?src-supplier=Element14; ComponentLink9URL: http://www.yageo.com/documents/recent/PYu-RC0603_51_RoHS_L_4.pdf?src-supplier=Avnet; ComponentLink9Description: http://www.yageo.com/documents/recent/PYu-RC0603_51_RoHS_L_4.pdf?src-supplier=Avnet; ComponentLink10URL: http://documents.rs-components.com/techlib://itc_doclist_GB.htm?stockno=5048984&src-supplier=RSComponents; ComponentLink10Description: http://documents.rs-components.com/techlib://itc_doclist_GB.htm?stockno=5048984&src-supplier=RSComponents; ComponentLink11URL: http://www.yageo.com/documents/recent/PYu-RC0603_51_RoHS_L_4.pdf?src-supplier=Avnet+Europe; ComponentLink11Description: http://www.yageo.com/documents/recent/PYu-RC0603_51_RoHS_L_4.pdf?src-supplier=Avnet+Europe
R78 R84 = R_0402: as R89 on sheet AnalogOutputs; ComponentLink1URL: http://www.farnell.com/datasheets/2167052.pdf?src-supplier=Element14; ComponentLink1Description: http://www.farnell.com/datasheets/2167052.pdf?src-supplier=Element14; ComponentLink2URL: http://www.farnell.com/datasheets/1784430.pdf?src-supplier=Element14; ComponentLink2Description: http://www.farnell.com/datasheets/1784430.pdf?src-supplier=Element14; ComponentLink3URL: http://documents.rs-components.com/techlib://itc_doclist_GB.htm?stockno=6185832&src-supplier=RSComponents; ComponentLink3Description: http://documents.rs-components.com/techlib://itc_doclist_GB.htm?stockno=6185832&src-supplier=RSComponents; ComponentLink4URL: http://www.yageo.com/documents/recent/PYu-RC0402_51_RoHS_L_6_r.pdf?src-supplier=Future+Electronics; ComponentLink4Description: http://www.yageo.com/documents/recent/PYu-RC0402_51_RoHS_L_6_r.pdf?src-supplier=Future+Electronics; ComponentLink5URL: http://www.farnell.com/datasheets/1686128.pdf?src-supplier=Element14; ComponentLink5Description: http://www.farnell.com/datasheets/1686128.pdf?src-supplier=Element14; ComponentLink6URL: http://www.farnell.com/datasheets/1018594.pdf?src-supplier=Element14; ComponentLink6Description: http://www.farnell.com/datasheets/1018594.pdf?src-supplier=Element14; ComponentLink7URL: http://www.yageo.com/documents/recent/PYu-RC_Group_51_RoHS_L_9.pdf?src-supplier=Mouser; ComponentLink7Description: http://www.yageo.com/documents/recent/PYu-RC_Group_51_RoHS_L_9.pdf?src-supplier=Mouser; Supplier 1: Digi-Key; Supplier 2: Digi-Key; Supplier Part Number 2: 311-80.6KHRCT-ND; Stock 2: 487759; Pricing 2: 1=0.1, 10=0.023, 100=0.0094, 1000=0.00421, 2500=0.00366 (USD); Mount: Surface Mount; Case/Package: 0603; Contact Plating: Tin,Matte; Case Code (Metric): 1608; Case Code (Imperial): 0603; Min Operating Temperature: -55°C; Max Operating Temperature: 155°C; Tolerance: 1%; Composition: Thick Film; Packaging: Tape and Reel; Package Quantity: 1; Number of Terminations: 2; Termination: SMD/SMT; Military Standard: Not; Max Power Dissipation: 100mW; Voltage Rating (DC): 50V; Features: Moisture Resistant; Length: 1.6mm; Height: 0.45mm; Width: 0.031inch; Depth: 0.8mm; Radiation Hardening: No; Lead Free: Lead Free; ComponentLink8URL: http://www.yageo.com/documents/recent/PYu-RC_Group_51_RoHS_L_9.pdf?src-supplier=Digi-Key; ComponentLink8Description: http://www.yageo.com/documents/recent/PYu-RC_Group_51_RoHS_L_9.pdf?src-supplier=Digi-Key; ComponentLink9URL: http://www.yageo.com/documents/recent/PYu-RC_Group_51_RoHS_L_10.pdf?src-supplier=Digi-Key; ComponentLink9Description: http://www.yageo.com/documents/recent/PYu-RC_Group_51_RoHS_L_10.pdf?src-supplier=Digi-Key; ComponentLink10URL: http://www.mouser.com/catalog/specsheets/RC0603.pdf?src-supplier=Mouser; ComponentLink10Description: http://www.mouser.com/catalog/specsheets/RC0603.pdf?src-supplier=Mouser; ComponentLink11URL: http://documents.rs-components.com/techlib://itc_doclist_GB.htm?stockno=5048473&src-supplier=RSComponents; ComponentLink11Description: http://documents.rs-components.com/techlib://itc_doclist_GB.htm?stockno=5048473&src-supplier=RSComponents
R79 R85 = R_0402: RES SMD 100 OHM 1% 1/10W 0603; Manufacturer: Yageo; Manufacturer Part Number: RC0603FR-07100RL; Resistance: 100R; Temperature Coefficient: 100ppm/°C; Voltage Rating (DC): 50V; Power Rating: 100mW; ComponentLink1URL: http://www.farnell.com/datasheets/2167052.pdf?src-supplier=Element14; ComponentLink1Description: http://www.farnell.com/datasheets/2167052.pdf?src-supplier=Element14; ComponentLink2URL: http://www.farnell.com/datasheets/1784430.pdf?src-supplier=Element14; ComponentLink2Description: http://www.farnell.com/datasheets/1784430.pdf?src-supplier=Element14; ComponentLink3URL: http://documents.rs-components.com/techlib://itc_doclist_GB.htm?stockno=6185832&src-supplier=RSComponents; ComponentLink3Description: http://documents.rs-components.com/techlib://itc_doclist_GB.htm?stockno=6185832&src-supplier=RSComponents; ComponentLink4URL: http://www.yageo.com/documents/recent/PYu-RC0402_51_RoHS_L_6_r.pdf?src-supplier=Future+Electronics; ComponentLink4Description: http://www.yageo.com/documents/recent/PYu-RC0402_51_RoHS_L_6_r.pdf?src-supplier=Future+Electronics; ComponentLink5URL: http://www.farnell.com/datasheets/1686128.pdf?src-supplier=Element14; ComponentLink5Description: http://www.farnell.com/datasheets/1686128.pdf?src-supplier=Element14; ComponentLink6URL: http://www.farnell.com/datasheets/1018594.pdf?src-supplier=Element14; ComponentLink6Description: http://www.farnell.com/datasheets/1018594.pdf?src-supplier=Element14; ComponentLink7URL: http://www.yageo.com/documents/recent/PYu-RC_Group_51_RoHS_L_9.pdf?src-supplier=Mouser; ComponentLink7Description: http://www.yageo.com/documents/recent/PYu-RC_Group_51_RoHS_L_9.pdf?src-supplier=Mouser; Supplier 1: Digi-Key; Supplier 2: Digi-Key; Supplier Part Number 2: 311-100HRCT-ND; Stock 2: 22383689; Pricing 2: 1=0.1, 10=0.021, 100=0.0084, 1000=0.00376, 2500=0.00327 (USD); Case/Package: 0603; Number of Pins: 2; Case Code (Imperial): 0603; Case Code (Metric): 1608; Min Operating Temperature: -55°C; Max Operating Temperature: 155°C; Tolerance: 1%; Composition: Thick Film; Packaging: Tape and Reel; Voltage Rating: 50V; Termination: SMD/SMT; Military Standard: Not; Length: 1.6mm; Height: 0.45mm; Width: 0.8mm; Depth: 0.8mm; REACH SVHC: Unknown; Lead Free: Lead Free; ComponentLink8URL: http://www.farnell.com/datasheets/1868787.pdf?src-supplier=Element14; ComponentLink8Description: http://www.farnell.com/datasheets/1868787.pdf?src-supplier=Element14; ComponentLink9URL: http://documents.rs-components.com/techlib://itc_doclist_GB.htm?stockno=5048912&src-supplier=RSComponents; ComponentLink9Description: http://documents.rs-components.com/techlib://itc_doclist_GB.htm?stockno=5048912&src-supplier=RSComponents; ComponentLink10URL: http://www.farnell.com/datasheets/443971.pdf?src-supplier=Element14; ComponentLink10Description: http://www.farnell.com/datasheets/443971.pdf?src-supplier=Element14
R81 R86 = R_0402: RES SMD 24.9 OHM 1% 1/10W 0603; Manufacturer: Yageo; Manufacturer Part Number: RC0603FR-0724R9L; Resistance: 24.9R; Power Rating: 100mW; Voltage Rating: 75V; Temperature Coefficient: 100ppm/°C; Voltage Rating (DC): 50V; ComponentLink1URL: http://www.farnell.com/datasheets/2167052.pdf?src-supplier=Element14; ComponentLink1Description: http://www.farnell.com/datasheets/2167052.pdf?src-supplier=Element14; ComponentLink2URL: http://www.farnell.com/datasheets/1784430.pdf?src-supplier=Element14; ComponentLink2Description: http://www.farnell.com/datasheets/1784430.pdf?src-supplier=Element14; ComponentLink3URL: http://documents.rs-components.com/techlib://itc_doclist_GB.htm?stockno=6185832&src-supplier=RSComponents; ComponentLink3Description: http://documents.rs-components.com/techlib://itc_doclist_GB.htm?stockno=6185832&src-supplier=RSComponents; ComponentLink4URL: http://www.yageo.com/documents/recent/PYu-RC0402_51_RoHS_L_6_r.pdf?src-supplier=Future+Electronics; ComponentLink4Description: http://www.yageo.com/documents/recent/PYu-RC0402_51_RoHS_L_6_r.pdf?src-supplier=Future+Electronics; ComponentLink5URL: http://www.farnell.com/datasheets/1686128.pdf?src-supplier=Element14; ComponentLink5Description: http://www.farnell.com/datasheets/1686128.pdf?src-supplier=Element14; ComponentLink6URL: http://www.farnell.com/datasheets/1018594.pdf?src-supplier=Element14; ComponentLink6Description: http://www.farnell.com/datasheets/1018594.pdf?src-supplier=Element14; ComponentLink7URL: http://www.yageo.com/documents/recent/PYu-RC_Group_51_RoHS_L_9.pdf?src-supplier=Mouser; ComponentLink7Description: http://www.yageo.com/documents/recent/PYu-RC_Group_51_RoHS_L_9.pdf?src-supplier=Mouser; Supplier 1: Digi-Key; Supplier 2: Digi-Key; Supplier Part Number 2: 311-24.9HRCT-ND; Stock 2: 382630; Pricing 2: 1=0.1, 10=0.023, 100=0.0094, 1000=0.00421, 2500=0.00366 (USD); Case/Package: 0603; Number of Pins: 2; Weight: 7.1E-05oz; Case Code (Metric): 1608; Case Code (Imperial): 0603; Min Operating Temperature: -55°C; Max Operating Temperature: 155°C; Package Quantity: 1; Tolerance: 1%; Packaging: Tape and Reel; Composition: Thick Film; Number of Terminations: 2; Termination: SMD/SMT; Military Standard: Not; Max Power Dissipation: 100mW; Working Voltage: 75V; Features: Moisture Resistant; Length: 1.6mm; Height: 0.45mm; Width: 0.031inch; Depth: 0.8mm; REACH SVHC: No SVHC; Lead Free: Lead Free; ComponentLink8URL: http://www.yageo.com/documents/recent/PYu-RC_Group_51_RoHS_L_9.pdf?src-supplier=Digi-Key; ComponentLink8Description: http://www.yageo.com/documents/recent/PYu-RC_Group_51_RoHS_L_9.pdf?src-supplier=Digi-Key; ComponentLink9URL: http://www.yageo.com/documents/recent/PYu-RC_Group_51_RoHS_L_10.pdf?src-supplier=Digi-Key; ComponentLink9Description: http://www.yageo.com/documents/recent/PYu-RC_Group_51_RoHS_L_10.pdf?src-supplier=Digi-Key; ComponentLink10URL: http://www.farnell.com/datasheets/443971.pdf?src-supplier=Element14; ComponentLink10Description: http://www.farnell.com/datasheets/443971.pdf?src-supplier=Element14; ComponentLink11URL: http://documents.rs-components.com/techlib://itc_doclist_GB.htm?stockno=5050707&src-supplier=RSComponents; ComponentLink11Description: http://documents.rs-components.com/techlib://itc_doclist_GB.htm?stockno=5050707&src-supplier=RSComponents
ROUT1 ROUT2 = R_0402: RES SMD 43K OHM 1% 1/10W 0603; Manufacturer: Yageo; Manufacturer Part Number: RC0603FR-0743KL; Resistance: 43kR; Power Rating: 100mW; Temperature Coefficient: 100ppm/°C; Voltage Rating: 50V; Working Voltage: 75V; ComponentLink1URL: http://www.farnell.com/datasheets/2167052.pdf?src-supplier=Element14; ComponentLink1Description: http://www.farnell.com/datasheets/2167052.pdf?src-supplier=Element14; ComponentLink2URL: http://www.farnell.com/datasheets/1784430.pdf?src-supplier=Element14; ComponentLink2Description: http://www.farnell.com/datasheets/1784430.pdf?src-supplier=Element14; ComponentLink3URL: http://documents.rs-components.com/techlib://itc_doclist_GB.htm?stockno=6185832&src-supplier=RSComponents; ComponentLink3Description: http://documents.rs-components.com/techlib://itc_doclist_GB.htm?stockno=6185832&src-supplier=RSComponents; ComponentLink4URL: http://www.yageo.com/documents/recent/PYu-RC0402_51_RoHS_L_6_r.pdf?src-supplier=Future+Electronics; ComponentLink4Description: http://www.yageo.com/documents/recent/PYu-RC0402_51_RoHS_L_6_r.pdf?src-supplier=Future+Electronics; ComponentLink5URL: http://www.farnell.com/datasheets/1686128.pdf?src-supplier=Element14; ComponentLink5Description: http://www.farnell.com/datasheets/1686128.pdf?src-supplier=Element14; ComponentLink6URL: http://www.farnell.com/datasheets/1018594.pdf?src-supplier=Element14; ComponentLink6Description: http://www.farnell.com/datasheets/1018594.pdf?src-supplier=Element14; ComponentLink7URL: http://www.yageo.com/documents/recent/PYu-RC_Group_51_RoHS_L_9.pdf?src-supplier=Mouser; ComponentLink7Description: http://www.yageo.com/documents/recent/PYu-RC_Group_51_RoHS_L_9.pdf?src-supplier=Mouser; ComponentLink8URL: http://www.yageo.com/documents/recent/PYu-RC_Group_51_RoHS_L_10.pdf?src-supplier=Digi-Key; ComponentLink8Description: http://www.yageo.com/documents/recent/PYu-RC_Group_51_RoHS_L_10.pdf?src-supplier=Digi-Key; ComponentLink9URL: http://documents.rs-components.com/techlib://itc_doclist_GB.htm?stockno=5048243&src-supplier=RSComponents; ComponentLink9Description: http://documents.rs-components.com/techlib://itc_doclist_GB.htm?stockno=5048243&src-supplier=RSComponents; ComponentLink10URL: http://www.yageo.com/documents/recent/PYu-RC_Group_51_RoHS_L_9.pdf?src-supplier=Digi-Key; ComponentLink10Description: http://www.yageo.com/documents/recent/PYu-RC_Group_51_RoHS_L_9.pdf?src-supplier=Digi-Key; ComponentLink11URL: http://www.farnell.com/datasheets/1868787.pdf?src-supplier=Element14; ComponentLink11Description: http://www.farnell.com/datasheets/1868787.pdf?src-supplier=Element14; ComponentLink12URL: http://www.farnell.com/datasheets/443971.pdf?src-supplier=Element14; ComponentLink12Description: http://www.farnell.com/datasheets/443971.pdf?src-supplier=Element14; Supplier 1: Digi-Key; Supplier Part Number 1: 311-43.0KHRCT-ND; Stock 1: 583820; Pricing 1: 1=0.1, 10=0.023, 100=0.0094, 1000=0.00421, 2500=0.00366 (USD); Case/Package: 0603; Case Code (Metric): 1608; Case Code (Imperial): 0603; Min Operating Temperature: -55°C; Max Operating Temperature: 155°C; Tolerance: 1%; Package Quantity: 1; Packaging: Tape and Reel; Composition: Thick Film; Number of Terminations: 2; Termination: SMD/SMT; Military Standard: Not; Max Power Dissipation: 100mW; Voltage Rating (DC): 50V; Features: Moisture Resistant; Length: 1.6mm; Height: 0.022inch; Depth: 0.8mm; Width: 0.031inch; Lead Free: Lead Free; ComponentLink13URL: http://www.mouser.com/catalog/specsheets/RC0603.pdf?src-supplier=Mouser; ComponentLink13Description: http://www.mouser.com/catalog/specsheets/RC0603.pdf?src-supplier=Mouser
U16 = IK0505SA: DC DC CONVERTER 5V 1W; Manufacturer: Recom; Min Input Voltage (DC): 4.5V; Max Input Voltage: 5.5V; Number of Outputs: 1; Max Output Current: 200mA; Efficiency: 76%; Isolation Voltage: 1kV; Isolation: Isolated; Supplier 1: Digi-Key; Supplier Part Number 1: 945-1654-5-ND; Manufacturer Part Number: REE-0505S; Stock 1: 3794; Pricing 1: 1=2.64, 5=2.604, 10=2.567, 25=2.4916, 50=2.416, 100=2.3405, 250=2.265, 500=2.114 (USD); Mount: Through Hole; Case/Package: SIP; Number of Pins: 4; Weight: 2.2g; Min Operating Temperature: -40°C; Max Operating Temperature: 85°C; Nominal Output Voltage: 5V; Output Voltage: 5V; Output Current: 200mA; Power Rating: 1W; Output Power: 1W; Min Input Voltage: 4.5V; Package Quantity: 25; Packaging: Rail/Tube; Voltage - Output 1: 5V; Current - Output 1: 200mA; Max Input Voltage (DC): 5.5V; Max Output Power: 1W; Nominal Input Voltage: 5V; Max Power Dissipation: 1W; Max Output Voltage: 5V; Length: 19.6mm; Height: 10.2mm; Width: 6mm; Depth: 6mm; REACH SVHC: No SVHC; Lead Free: Lead Free; ComponentLink1URL: http://www.mouser.com/ds/2/468/REE-958304.pdf?src-supplier=Mouser; ComponentLink1Description: http://www.mouser.com/ds/2/468/REE-958304.pdf?src-supplier=Mouser; ComponentLink2URL: http://www.recom-international.com/pdf/Econoline/REE.pdf?src-supplier=Future+Electronics; ComponentLink2Description: http://www.recom-international.com/pdf/Econoline/REE.pdf?src-supplier=Future+Electronics; ComponentLink3URL: https://www.recom-power.com/pdf/Econoline/REE.pdf?src-supplier=Digi-Key; ComponentLink3Description: https://www.recom-power.com/pdf/Econoline/REE.pdf?src-supplier=Digi-Key; ComponentLink4URL: http://www.farnell.com/datasheets/1662783.pdf?src-supplier=Element14; ComponentLink4Description: http://www.farnell.com/datasheets/1662783.pdf?src-supplier=Element14; ComponentLink5URL: http://www.rapidonline.com/pdf/676197_da_en_01.pdf?src-supplier=Rapid+Electronics; ComponentLink5Description: http://www.rapidonline.com/pdf/676197_da_en_01.pdf?src-supplier=Rapid+Electronics; ComponentLink6URL: http://www.produktinfo.conrad.com/datenblaetter/675000-699999/676197-da-01-en-DC_DC_WANDLER_REE_0505S.pdf?src-supplier=Conrad; ComponentLink6Description: http://www.produktinfo.conrad.com/datenblaetter/675000-699999/676197-da-01-en-DC_DC_WANDLER_REE_0505S.pdf?src-supplier=Conrad
U17 U18 U20 U23 = HCNR200: OPTOISO 5KV LINEAR PHVOLT 8DIP; Manufacturer: Broadcom; Number of Channels: 1; Forward Voltage: 1.6V; Supplier 1: Digi-Key; Supplier Part Number 1: 516-1523-5-ND; Manufacturer Part Number: HCNR201-000E; Stock 1: 774; Pricing 1: 1=5.36, 10=4.469, 100=3.1285, 500=2.59216, 1000=2.37764, 2500=2.27932 (USD); Mount: Through Hole; Case/Package: DIP; Number of Pins: 8; Min Operating Temperature: -55°C; Max Operating Temperature: 100°C; Packaging: Rail/Tube; Isolation Voltage: 5kV; REACH SVHC: No SVHC
U19 = SN74LV4051A: IC MUX/DEMUX 8X1 16SOIC; Manufacturer: Texas Instruments; Manufacturer Part Number: SN74LV4051ADR; Min Supply Voltage: 2V; Max Supply Voltage: 5.5V; Number of Channels: 1; Propagation Delay: 12ns; Nominal Supply Current: 20mA; Logic Function: Multiplexer,Demultiplexer; On-State Resistance: 100R; Operating Supply Current: 20uA; Turn-On Delay Time: 28ns; Supply Type: Single; Number of Bits: 8; Bandwidth: 35MHz; Polarity: Non-Inverting; Low Level Output Current: 25mA; Supplier 1: Digi-Key; Supplier Part Number 1: 296-3827-1-ND; Stock 1: 80764; Pricing 1: 1=0.42, 10=0.355, 100=0.2653, 500=0.20848, 1000=0.16109 (USD); Mount: Surface Mount; Case/Package: SOIC; Number of Pins: 16; Weight: 0.004998oz; Contact Plating: Gold; Min Operating Temperature: -40°C; Max Operating Temperature: 85°C; Packaging: Tape and Reel; Package Quantity: 2500; Turn-Off Delay Time: 28ns; Number of Inputs: 8; Number of Outputs: 1; Number of Circuits: 1; High Level Output Current: 25mA; Radiation Hardening: No; Lead Free: Lead Free; REACH SVHC: No SVHC; ComponentLink1URL: http://focus.ti.com/lit/ds/symlink/sn74lv4051a.pdf?src-supplier=Avnet+Europe; ComponentLink1Description: http://focus.ti.com/lit/ds/symlink/sn74lv4051a.pdf?src-supplier=Avnet+Europe; ComponentLink2URL: http://www.ti.com/lit/ds/symlink/sn74lv4051a.pdf?src-supplier=Digi-Key; ComponentLink2Description: http://www.ti.com/lit/ds/symlink/sn74lv4051a.pdf?src-supplier=Digi-Key; ComponentLink3URL: https://www.verical.com/server-webapp/html/getDatasheet?partID=48893&src-supplier=Verical; ComponentLink3Description: https://www.verical.com/server-webapp/html/getDatasheet?partID=48893&src-supplier=Verical; ComponentLink4URL: http://www.farnell.com/datasheets/1847464.pdf?src-supplier=Element14; ComponentLink4Description: http://www.farnell.com/datasheets/1847464.pdf?src-supplier=Element14; ComponentLink5URL: http://www.farnell.com/datasheets/1992225.pdf?src-supplier=Element14; ComponentLink5Description: http://www.farnell.com/datasheets/1992225.pdf?src-supplier=Element14
U21 U22 U24 U25 = AMP OP: IC OPAMP GP 1 CIRCUIT SC88A; Manufacturer: ON Semiconductor; Number of Circuits: 1; Slew Rate: 1.2V/µs; Gain Bandwidth Product: 3MHz; Input Bias Current: 1pA; Input Offset Voltage (Vos): 500uV; Operating Supply Current: 140uA; Output Current per Channel: 19mA; Supplier 1: Digi-Key; Supplier Part Number 1: NCS20061SQ3T2GOSCT-ND; Manufacturer Part Number: NCS20061SQ3T2G; Stock 1: 3240; Pricing 1: 1=0.57, 10=0.488, 100=0.338, 500=0.273, 1000=0.2015 (USD); Mount: Surface Mount; Min Operating Temperature: -40°C; Max Operating Temperature: 125°C; Packaging: Cut Tape; ComponentLink1URL: http://www.onsemi.com/pub/Collateral/NCS2006-D.PDF?src-supplier=Digi-Key; ComponentLink1Description: http://www.onsemi.com/pub/Collateral/NCS2006-D.PDF?src-supplier=Digi-Key